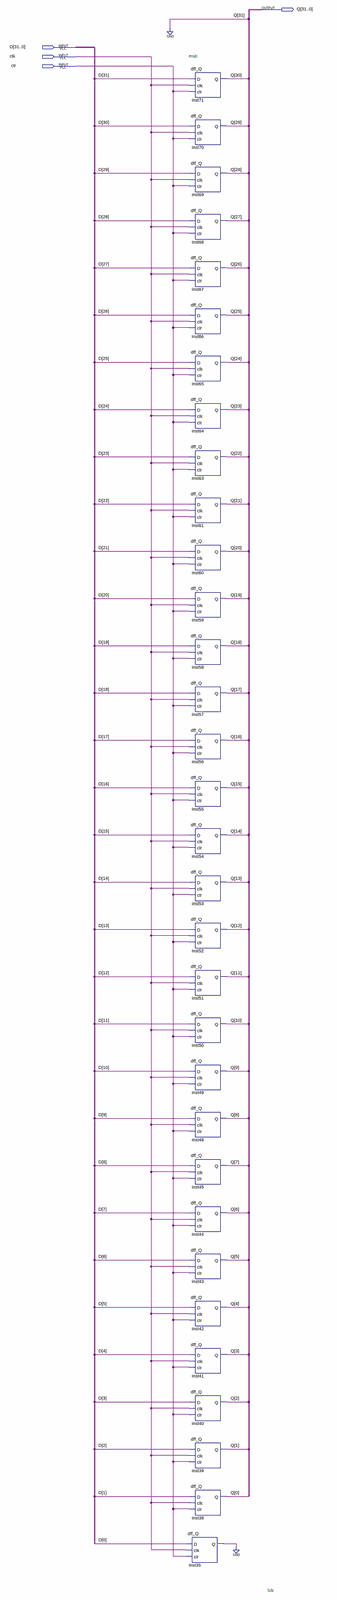
[diagram p0: schematic sheet, whole]
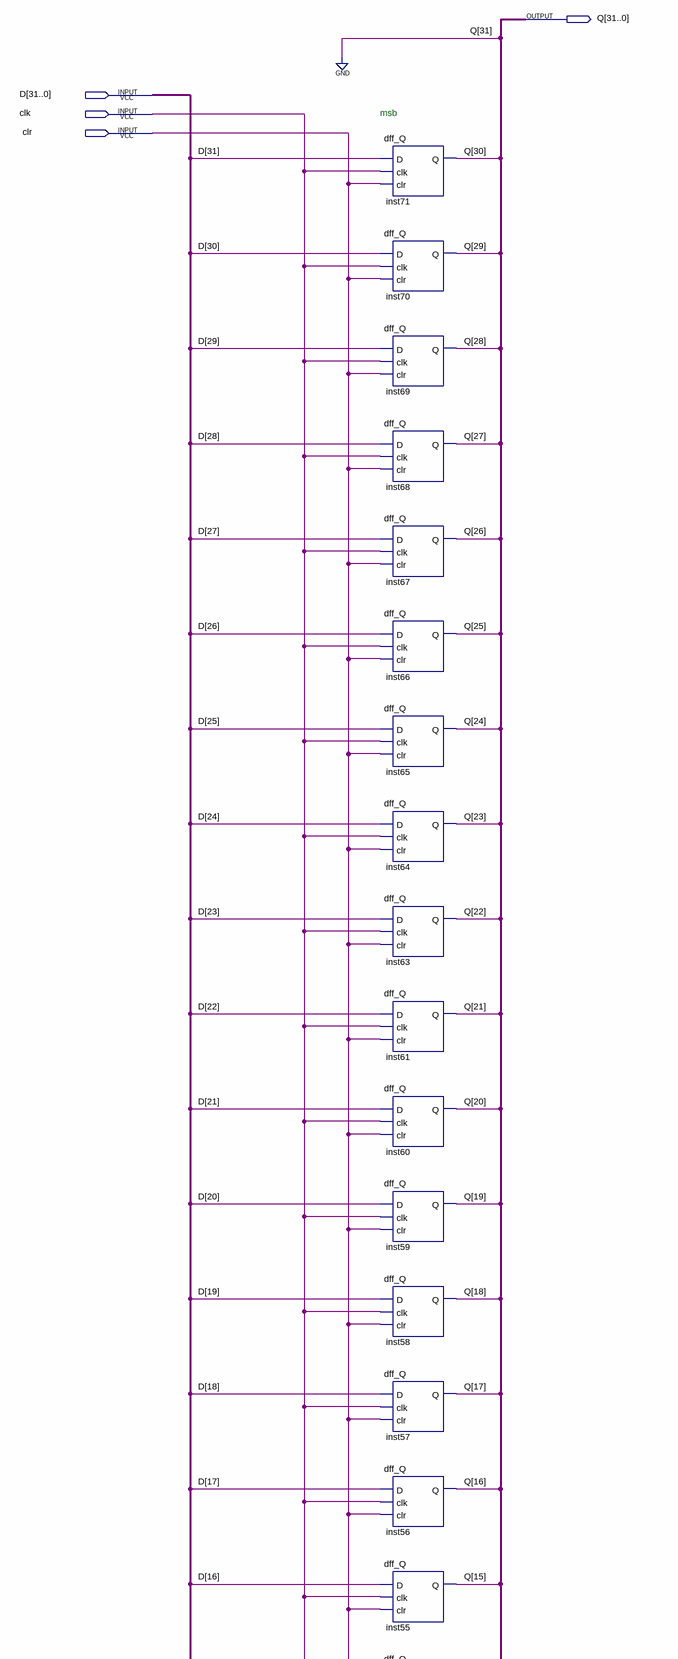
[diagram p1: schematic sheet, upper part]
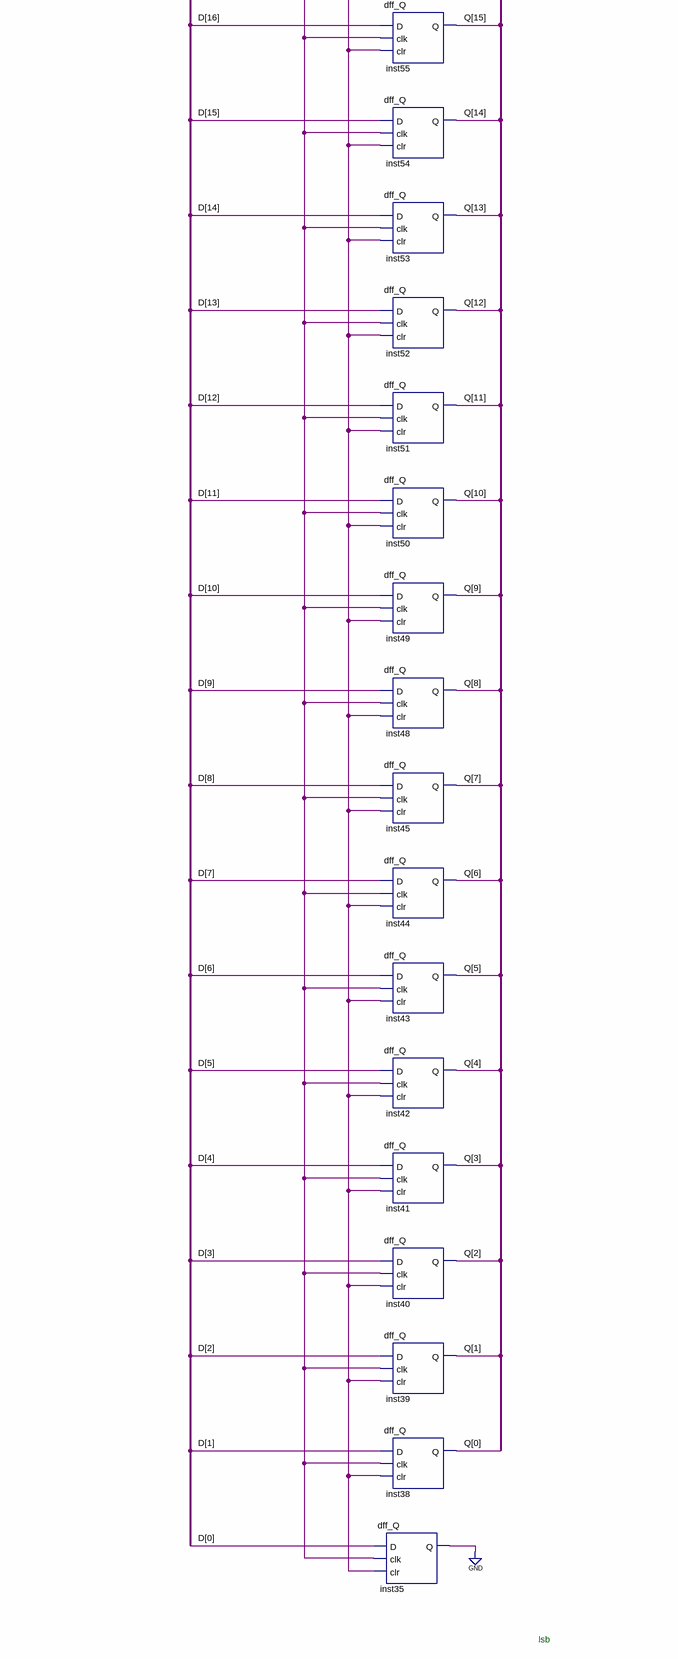
[diagram p2: schematic sheet, lower part]
// Quartus schematic right_shift_logic.bdf as structural Verilog: 32 symbols, 4 pins
module right_shift_logic (
  input  [31:0] D,
  input  clk,
  input  clr,
  output [31:0] Q
);

  wire inst35_q;

  dff_Q inst71 (.D(D[31]), .clk(clk), .clr(clr), .Q(Q[30]));
  dff_Q inst70 (.D(D[30]), .clk(clk), .clr(clr), .Q(Q[29]));
  dff_Q inst69 (.D(D[29]), .clk(clk), .clr(clr), .Q(Q[28]));
  dff_Q inst68 (.D(D[28]), .clk(clk), .clr(clr), .Q(Q[27]));
  dff_Q inst67 (.D(D[27]), .clk(clk), .clr(clr), .Q(Q[26]));
  dff_Q inst66 (.D(D[26]), .clk(clk), .clr(clr), .Q(Q[25]));
  dff_Q inst65 (.D(D[25]), .clk(clk), .clr(clr), .Q(Q[24]));
  dff_Q inst64 (.D(D[24]), .clk(clk), .clr(clr), .Q(Q[23]));
  dff_Q inst63 (.D(D[23]), .clk(clk), .clr(clr), .Q(Q[22]));
  dff_Q inst61 (.D(D[22]), .clk(clk), .clr(clr), .Q(Q[21]));
  dff_Q inst60 (.D(D[21]), .clk(clk), .clr(clr), .Q(Q[20]));
  dff_Q inst59 (.D(D[20]), .clk(clk), .clr(clr), .Q(Q[19]));
  dff_Q inst58 (.D(D[19]), .clk(clk), .clr(clr), .Q(Q[18]));
  dff_Q inst57 (.D(D[18]), .clk(clk), .clr(clr), .Q(Q[17]));
  dff_Q inst56 (.D(D[17]), .clk(clk), .clr(clr), .Q(Q[16]));
  dff_Q inst55 (.D(D[16]), .clk(clk), .clr(clr), .Q(Q[15]));
  dff_Q inst54 (.D(D[15]), .clk(clk), .clr(clr), .Q(Q[14]));
  dff_Q inst53 (.D(D[14]), .clk(clk), .clr(clr), .Q(Q[13]));
  dff_Q inst52 (.D(D[13]), .clk(clk), .clr(clr), .Q(Q[12]));
  dff_Q inst51 (.D(D[12]), .clk(clk), .clr(clr), .Q(Q[11]));
  dff_Q inst50 (.D(D[11]), .clk(clk), .clr(clr), .Q(Q[10]));
  dff_Q inst49 (.D(D[10]), .clk(clk), .clr(clr), .Q(Q[9]));
  dff_Q inst48 (.D(D[9]), .clk(clk), .clr(clr), .Q(Q[8]));
  dff_Q inst45 (.D(D[8]), .clk(clk), .clr(clr), .Q(Q[7]));
  dff_Q inst44 (.D(D[7]), .clk(clk), .clr(clr), .Q(Q[6]));
  dff_Q inst43 (.D(D[6]), .clk(clk), .clr(clr), .Q(Q[5]));
  dff_Q inst42 (.D(D[5]), .clk(clk), .clr(clr), .Q(Q[4]));
  dff_Q inst41 (.D(D[4]), .clk(clk), .clr(clr), .Q(Q[3]));
  dff_Q inst40 (.D(D[3]), .clk(clk), .clr(clr), .Q(Q[2]));
  dff_Q inst39 (.D(D[2]), .clk(clk), .clr(clr), .Q(Q[1]));
  dff_Q inst38 (.D(D[1]), .clk(clk), .clr(clr), .Q(Q[0]));
  dff_Q inst35 (.D(D[0]), .clk(clk), .clr(clr), .Q(inst35_q));

  assign Q[31] = 1'b0;
  // also tied to GND on the sheet: inst35_q

  // Notes on the sheet:
  //   msb
  //   lsb
endmodule
